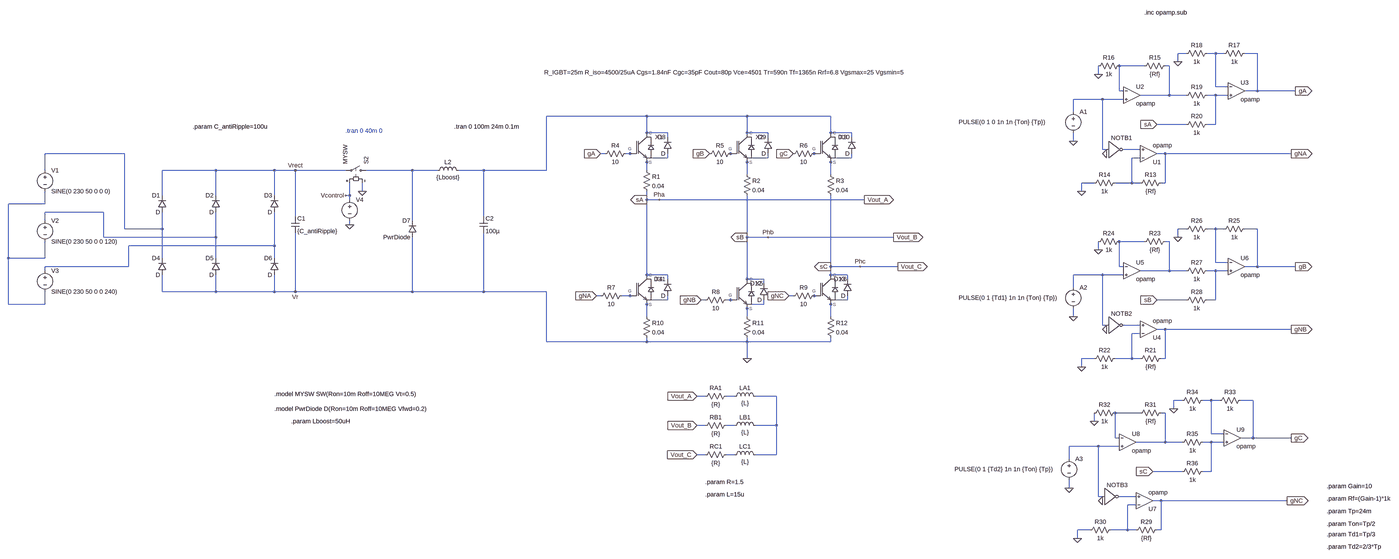
[diagram p0: schematic CompleteServoAmplifierCircuit.asc, whole sheet]
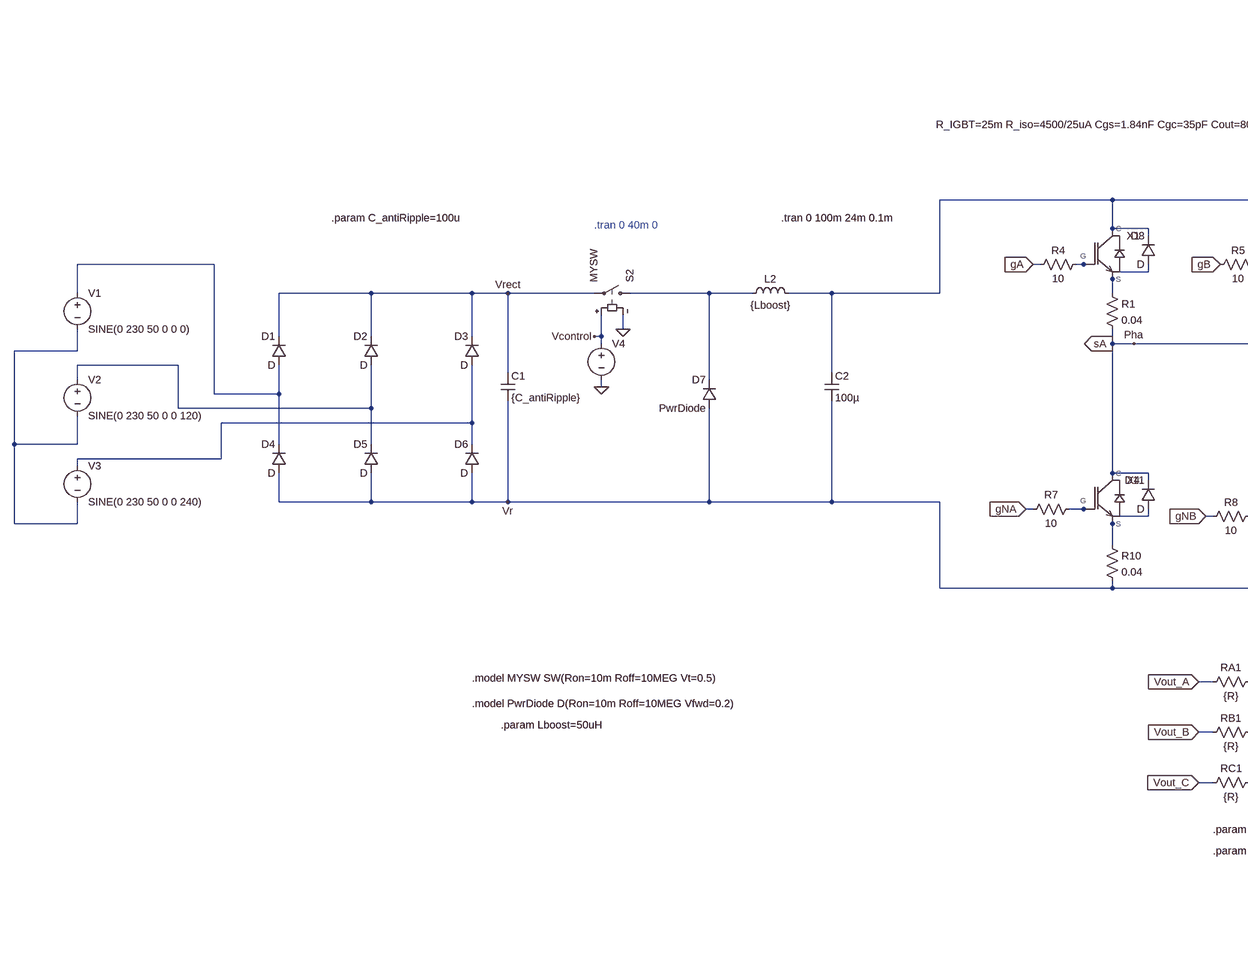
[diagram p1: schematic CompleteServoAmplifierCircuit.asc, part, row 1 of 1, column 1 of 2]
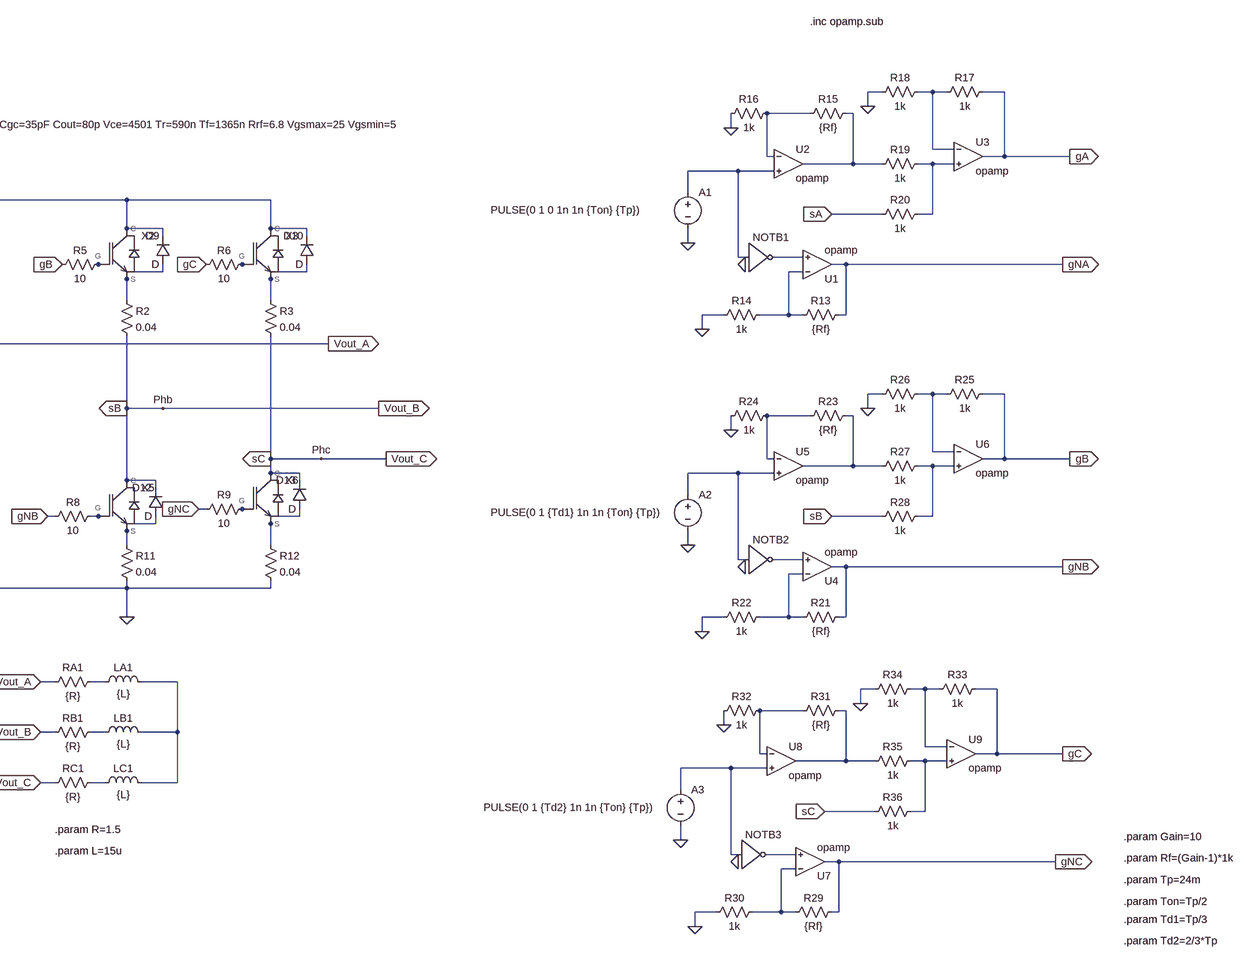
[diagram p2: schematic CompleteServoAmplifierCircuit.asc, part, row 1 of 1, column 2 of 2]
CompleteServoAmplifierCircuit.asc, the LTspice schematic file:
Version 4
SHEET 1 5052 1440
WIRE 4000 -464 3968 -464
WIRE 4112 -464 4080 -464
WIRE 4144 -464 4112 -464
WIRE 4272 -464 4224 -464
WIRE 3968 -432 3968 -464
WIRE 3840 -416 3744 -416
WIRE 3936 -416 3920 -416
WIRE 3664 -384 3664 -416
WIRE 4112 -336 4112 -464
WIRE 4160 -336 4112 -336
WIRE 3744 -320 3744 -416
WIRE 3760 -320 3744 -320
WIRE 4272 -320 4272 -464
WIRE 4272 -320 4224 -320
WIRE 4656 -320 4272 -320
WIRE 3936 -304 3936 -416
WIRE 3936 -304 3824 -304
WIRE 4000 -304 3936 -304
WIRE 4112 -304 4080 -304
WIRE 4160 -304 4112 -304
WIRE 3680 -288 3568 -288
WIRE 3760 -288 3680 -288
WIRE 3568 -240 3568 -288
WIRE 1872 -224 1488 -224
WIRE 2256 -224 1872 -224
WIRE 2576 -224 2256 -224
WIRE 4000 -192 3888 -192
WIRE 4112 -192 4112 -304
WIRE 4112 -192 4080 -192
WIRE 1872 -160 1872 -224
WIRE 1952 -160 1872 -160
WIRE 2256 -160 2256 -224
WIRE 2336 -160 2256 -160
WIRE 2576 -160 2576 -224
WIRE 2656 -160 2576 -160
WIRE 1952 -144 1952 -160
WIRE 2336 -144 2336 -160
WIRE 2656 -144 2656 -160
WIRE 3568 -128 3568 -160
WIRE 3680 -96 3680 -288
WIRE 3696 -96 3680 -96
WIRE 3824 -96 3760 -96
WIRE -160 -80 -464 -80
WIRE 1712 -80 1696 -80
WIRE 1808 -80 1792 -80
WIRE 1824 -80 1808 -80
WIRE 2208 -80 2192 -80
WIRE 2528 -80 2512 -80
WIRE 3920 -80 3888 -80
WIRE 4640 -80 3920 -80
WIRE 1952 -64 1952 -80
WIRE 1952 -64 1872 -64
WIRE 2336 -64 2336 -80
WIRE 2336 -64 2256 -64
WIRE 2656 -64 2656 -80
WIRE 2656 -64 2576 -64
WIRE 3824 -64 3792 -64
WIRE 1872 -48 1872 -64
WIRE 2256 -48 2256 -64
WIRE 2576 -48 2576 -64
WIRE -464 -16 -464 -80
WIRE 224 -16 -16 -16
WIRE 448 -16 224 -16
WIRE 528 -16 448 -16
WIRE 720 -16 528 -16
WIRE 976 -16 800 -16
WIRE 1072 -16 976 -16
WIRE 1248 -16 1152 -16
WIRE 1488 -16 1488 -224
WIRE 1488 -16 1248 -16
WIRE 1872 -16 1872 -48
WIRE 2256 0 2256 -48
WIRE 2576 0 2576 -48
WIRE 3648 32 3600 32
WIRE 3792 32 3792 -64
WIRE 3792 32 3728 32
WIRE 3824 32 3792 32
WIRE 3920 32 3920 -80
WIRE 3920 32 3904 32
WIRE 784 64 784 32
WIRE 3600 64 3600 32
WIRE -16 80 -16 -16
WIRE 224 80 224 -16
WIRE 448 80 448 -16
WIRE 736 80 736 32
WIRE 736 80 720 80
WIRE 736 96 736 80
WIRE 1872 96 1872 64
WIRE 1920 96 1872 96
WIRE 2704 96 1920 96
WIRE -464 112 -464 64
WIRE -464 112 -656 112
WIRE -240 144 -464 144
WIRE 528 160 528 -16
WIRE 1248 160 1248 -16
WIRE -464 176 -464 144
WIRE 976 176 976 -16
WIRE 736 192 736 176
WIRE -160 208 -160 -80
WIRE -16 208 -16 144
WIRE -16 208 -160 208
WIRE 4000 208 3968 208
WIRE 4112 208 4080 208
WIRE 4144 208 4112 208
WIRE 4272 208 4224 208
WIRE -240 240 -240 144
WIRE 224 240 224 144
WIRE 224 240 -240 240
WIRE 2256 240 2256 80
WIRE 2336 240 2256 240
WIRE 2816 240 2336 240
WIRE 3968 240 3968 208
WIRE 3840 256 3744 256
WIRE 3936 256 3920 256
WIRE 448 272 448 144
WIRE 448 272 -144 272
WIRE 3664 288 3664 256
WIRE -656 320 -656 112
WIRE -464 320 -464 256
WIRE -464 320 -656 320
WIRE -16 320 -16 208
WIRE 224 320 224 240
WIRE 448 320 448 272
WIRE 4112 336 4112 208
WIRE 4160 336 4112 336
WIRE -144 352 -144 272
WIRE -144 352 -464 352
WIRE 2576 352 2576 80
WIRE 2688 352 2576 352
WIRE 2832 352 2688 352
WIRE 3744 352 3744 256
WIRE 3760 352 3744 352
WIRE 4272 352 4272 208
WIRE 4272 352 4224 352
WIRE 4656 352 4272 352
WIRE -464 368 -464 352
WIRE 3936 368 3936 256
WIRE 3936 368 3824 368
WIRE 4000 368 3936 368
WIRE 4112 368 4080 368
WIRE 4160 368 4112 368
WIRE 1872 384 1872 96
WIRE 1952 384 1872 384
WIRE 2576 384 2576 352
WIRE 2640 384 2576 384
WIRE 3680 384 3568 384
WIRE 3760 384 3680 384
WIRE 1952 400 1952 384
WIRE 2256 400 2256 240
WIRE 2320 400 2256 400
WIRE 2640 400 2640 384
WIRE 2320 416 2320 400
WIRE 3568 432 3568 384
WIRE -16 448 -16 384
WIRE 224 448 224 384
WIRE 224 448 -16 448
WIRE 448 448 448 384
WIRE 448 448 224 448
WIRE 528 448 528 224
WIRE 528 448 448 448
WIRE 976 448 976 240
WIRE 976 448 528 448
WIRE 1248 448 1248 224
WIRE 1248 448 976 448
WIRE 1488 448 1248 448
WIRE 1696 464 1680 464
WIRE 1808 464 1776 464
WIRE 1824 464 1808 464
WIRE 2432 464 2416 464
WIRE 2528 464 2512 464
WIRE 1952 480 1952 464
WIRE 1952 480 1872 480
WIRE 2096 480 2080 480
WIRE 2192 480 2176 480
WIRE 2208 480 2192 480
WIRE 2640 480 2640 464
WIRE 2640 480 2576 480
WIRE 4000 480 3888 480
WIRE 4112 480 4112 368
WIRE 4112 480 4080 480
WIRE -656 496 -656 320
WIRE -464 496 -464 448
WIRE -464 496 -656 496
WIRE 1872 496 1872 480
WIRE 2320 496 2320 480
WIRE 2320 496 2256 496
WIRE 2576 496 2576 480
WIRE 2256 512 2256 496
WIRE 1872 544 1872 496
WIRE 2256 544 2256 512
WIRE 2576 544 2576 496
WIRE 3568 544 3568 512
WIRE 3680 576 3680 384
WIRE 3696 576 3680 576
WIRE 3824 576 3760 576
WIRE 3920 592 3888 592
WIRE 4640 592 3920 592
WIRE 3824 608 3792 608
WIRE 1488 640 1488 448
WIRE 1872 640 1872 624
WIRE 1872 640 1488 640
WIRE 2256 640 2256 624
WIRE 2256 640 1872 640
WIRE 2576 640 2576 624
WIRE 2576 640 2256 640
WIRE 2256 704 2256 640
WIRE 3648 704 3600 704
WIRE 3792 704 3792 608
WIRE 3792 704 3728 704
WIRE 3824 704 3792 704
WIRE 3920 704 3920 592
WIRE 3920 704 3904 704
WIRE 3600 736 3600 704
WIRE 2096 848 2064 848
WIRE 2208 848 2176 848
WIRE 2368 848 2288 848
WIRE 3984 864 3952 864
WIRE 4096 864 4064 864
WIRE 4128 864 4096 864
WIRE 4256 864 4208 864
WIRE 3952 896 3952 864
WIRE 3824 912 3728 912
WIRE 3920 912 3904 912
WIRE 3648 944 3648 912
WIRE 2096 960 2064 960
WIRE 2208 960 2176 960
WIRE 2368 960 2368 848
WIRE 2368 960 2288 960
WIRE 4096 992 4096 864
WIRE 4144 992 4096 992
WIRE 3728 1008 3728 912
WIRE 3744 1008 3728 1008
WIRE 4256 1008 4256 864
WIRE 4256 1008 4208 1008
WIRE 4640 1008 4256 1008
WIRE 3920 1024 3920 912
WIRE 3920 1024 3808 1024
WIRE 3984 1024 3920 1024
WIRE 4096 1024 4064 1024
WIRE 4144 1024 4096 1024
WIRE 3664 1040 3552 1040
WIRE 3744 1040 3664 1040
WIRE 2096 1072 2064 1072
WIRE 2208 1072 2176 1072
WIRE 2368 1072 2368 960
WIRE 2368 1072 2288 1072
WIRE 3552 1088 3552 1040
WIRE 3984 1136 3872 1136
WIRE 4096 1136 4096 1024
WIRE 4096 1136 4064 1136
WIRE 3552 1200 3552 1168
WIRE 3664 1232 3664 1040
WIRE 3680 1232 3664 1232
WIRE 3808 1232 3744 1232
WIRE 3904 1248 3872 1248
WIRE 4624 1248 3904 1248
WIRE 3808 1264 3776 1264
WIRE 3632 1360 3584 1360
WIRE 3776 1360 3776 1264
WIRE 3776 1360 3712 1360
WIRE 3808 1360 3776 1360
WIRE 3904 1360 3904 1248
WIRE 3904 1360 3888 1360
WIRE 3584 1392 3584 1360
FLAG 528 -16 Vrect
FLAG 528 448 Vr
FLAG 784 64 0
FLAG 736 192 0
FLAG 720 80 Vcontrol
FLAG 2064 848 Vout_A
IOPIN 2064 848 In
FLAG 2064 960 Vout_B
IOPIN 2064 960 In
FLAG 2064 1072 Vout_C
IOPIN 2064 1072 In
FLAG 2256 704 0
FLAG 1920 96 Pha
FLAG 2336 240 Phb
FLAG 2688 352 Phc
FLAG 1680 464 gNA
IOPIN 1680 464 In
FLAG 1696 -80 gA
IOPIN 1696 -80 In
FLAG 2112 -80 gB
IOPIN 2112 -80 In
FLAG 2432 -80 gC
IOPIN 2432 -80 In
FLAG 2080 480 gNB
IOPIN 2080 480 In
FLAG 2416 464 gNC
IOPIN 2416 464 In
FLAG 2704 96 Vout_A
IOPIN 2704 96 Out
FLAG 2816 240 Vout_B
IOPIN 2816 240 Out
FLAG 2832 352 Vout_C
IOPIN 2832 352 Out
FLAG 1872 96 sA
IOPIN 1872 96 Out
FLAG 2256 240 sB
IOPIN 2256 240 Out
FLAG 2576 352 sC
IOPIN 2576 352 Out
FLAG 4656 -320 gA
IOPIN 4656 -320 Out
FLAG 4640 -80 gNA
IOPIN 4640 -80 Out
FLAG 3568 -128 0
FLAG 3696 -80 0
FLAG 3600 64 0
FLAG 3664 -384 0
FLAG 3888 -192 sA
IOPIN 3888 -192 In
FLAG 3968 -432 0
FLAG 4656 352 gB
IOPIN 4656 352 Out
FLAG 4640 592 gNB
IOPIN 4640 592 Out
FLAG 3568 544 0
FLAG 3696 592 0
FLAG 3600 736 0
FLAG 3664 288 0
FLAG 3888 480 sB
IOPIN 3888 480 In
FLAG 3968 240 0
FLAG 4640 1008 gC
IOPIN 4640 1008 Out
FLAG 4624 1248 gNC
IOPIN 4624 1248 Out
FLAG 3552 1200 0
FLAG 3680 1248 0
FLAG 3584 1392 0
FLAG 3648 944 0
FLAG 3872 1136 sC
IOPIN 3872 1136 In
FLAG 3952 896 0
SYMBOL diode 0 144 R180
WINDOW 0 24 64 Left 2
WINDOW 3 24 0 Left 2
SYMATTR InstName D1
SYMBOL diode 240 144 R180
WINDOW 0 24 64 Left 2
WINDOW 3 24 0 Left 2
SYMATTR InstName D2
SYMBOL diode 464 144 R180
WINDOW 0 24 64 Left 2
WINDOW 3 24 0 Left 2
SYMATTR InstName D3
SYMBOL diode 0 384 R180
WINDOW 0 24 64 Left 2
WINDOW 3 24 0 Left 2
SYMATTR InstName D4
SYMBOL diode 240 384 R180
WINDOW 0 24 64 Left 2
WINDOW 3 24 0 Left 2
SYMATTR InstName D5
SYMBOL diode 464 384 R180
WINDOW 0 24 64 Left 2
WINDOW 3 24 0 Left 2
SYMATTR InstName D6
SYMBOL voltage -464 -32 R0
WINDOW 123 0 0 Left 0
WINDOW 39 0 0 Left 0
SYMATTR InstName V1
SYMATTR Value SINE(0 230 50 0 0 0)
SYMBOL voltage -464 160 R0
WINDOW 123 0 0 Left 0
WINDOW 39 0 0 Left 0
SYMATTR InstName V2
SYMATTR Value SINE(0 230 50 0 0 120)
SYMBOL voltage -464 352 R0
WINDOW 123 0 0 Left 0
WINDOW 39 0 0 Left 0
SYMATTR InstName V3
SYMATTR Value SINE(0 230 50 0 0 240)
SYMBOL sw 816 -16 M270
SYMATTR InstName S2
SYMATTR Value MYSW
SYMBOL voltage 736 80 R0
WINDOW 3 15 111 Invisible 2
WINDOW 123 0 0 Left 0
WINDOW 39 0 0 Left 0
SYMATTR Value PULSE(0 1 0 1n 1n {0.054*50u} 50u)
SYMATTR InstName V4
SYMBOL ind 1056 0 R270
WINDOW 0 32 56 VTop 2
WINDOW 3 5 56 VBottom 2
SYMATTR InstName L2
SYMATTR Value {Lboost}
SYMBOL diode 992 240 R180
WINDOW 0 24 64 Left 2
WINDOW 3 24 0 Left 2
SYMATTR InstName D7
SYMATTR Value PwrDiode
SYMBOL cap 1232 160 R0
SYMATTR InstName C2
SYMATTR Value 100µ
SYMBOL ind 2192 864 R270
WINDOW 0 32 56 VTop 2
WINDOW 3 5 56 VBottom 2
SYMATTR InstName LA1
SYMATTR Value {L}
SYMBOL ind 2192 976 R270
WINDOW 0 32 56 VTop 2
WINDOW 3 5 56 VBottom 2
SYMATTR InstName LB1
SYMATTR Value {L}
SYMBOL ind 2192 1088 R270
WINDOW 0 32 56 VTop 2
WINDOW 3 5 56 VBottom 2
SYMATTR InstName LC1
SYMATTR Value {L}
SYMBOL res 2080 864 R270
WINDOW 0 32 56 VTop 2
WINDOW 3 0 56 VBottom 2
SYMATTR InstName RA1
SYMATTR Value {R}
SYMBOL res 2080 976 R270
WINDOW 0 32 56 VTop 2
WINDOW 3 0 56 VBottom 2
SYMATTR InstName RB1
SYMATTR Value {R}
SYMBOL res 2080 1088 R270
WINDOW 0 32 56 VTop 2
WINDOW 3 0 56 VBottom 2
SYMATTR InstName RC1
SYMATTR Value {R}
SYMBOL IGBT_model 1840 -64 R0
WINDOW 39 -360 -327 Left 2
SYMATTR SpiceLine R_IGBT=25m R_iso=4500/25uA Cgs=1.84nF Cgc=35pF Cout=80p Vce=4501 Tr=590n Tf=1365n Rrf=6.8 Vgsmax=25 Vgsmin=5
SYMATTR InstName X1
SYMBOL IGBT_model 2224 -64 R0
SYMATTR SpiceLine R_IGBT=25m R_iso=4500/25uA Cgs=1.84nF Cgc=35pF Cout=80p Vce=4501 Tr=590n Tf=1365n Rrf=6.8 Vgsmax=25 Vgsmin=5
SYMATTR InstName X2
SYMBOL IGBT_model 2544 -64 R0
SYMATTR SpiceLine R_IGBT=25m R_iso=4500/25uA Cgs=1.84nF Cgc=35pF Cout=80p Vce=4501 Tr=590n Tf=1365n Rrf=6.8 Vgsmax=25 Vgsmin=5
SYMATTR InstName X3
SYMBOL IGBT_model 1840 480 R0
SYMATTR SpiceLine R_IGBT=25m R_iso=4500/25uA Cgs=1.84nF Cgc=35pF Cout=80p Vce=4501 Tr=590n Tf=1365n Rrf=6.8 Vgsmax=25 Vgsmin=5
SYMATTR InstName X4
SYMBOL IGBT_model 2224 496 R0
SYMATTR SpiceLine R_IGBT=25m R_iso=4500/25uA Cgs=1.84nF Cgc=35pF Cout=80p Vce=4501 Tr=590n Tf=1365n Rrf=6.8 Vgsmax=25 Vgsmin=5
SYMATTR InstName X5
SYMBOL IGBT_model 2544 480 R0
SYMATTR SpiceLine R_IGBT=25m R_iso=4500/25uA Cgs=1.84nF Cgc=35pF Cout=80p Vce=4501 Tr=590n Tf=1365n Rrf=6.8 Vgsmax=25 Vgsmin=5
SYMATTR InstName X6
SYMBOL res 1856 -32 R0
SYMATTR InstName R1
SYMATTR Value 0.04
SYMBOL res 2240 -16 R0
SYMATTR InstName R2
SYMATTR Value 0.04
SYMBOL res 2560 -16 R0
SYMATTR InstName R3
SYMATTR Value 0.04
SYMBOL res 1808 -96 R90
WINDOW 0 0 56 VBottom 2
WINDOW 3 32 56 VTop 2
SYMATTR InstName R4
SYMATTR Value 10
SYMBOL res 2208 -96 R90
WINDOW 0 0 56 VBottom 2
WINDOW 3 32 56 VTop 2
SYMATTR InstName R5
SYMATTR Value 10
SYMBOL res 2528 -96 R90
WINDOW 0 0 56 VBottom 2
WINDOW 3 32 56 VTop 2
SYMATTR InstName R6
SYMATTR Value 10
SYMBOL res 1792 448 R90
WINDOW 0 0 56 VBottom 2
WINDOW 3 32 56 VTop 2
SYMATTR InstName R7
SYMATTR Value 10
SYMBOL res 2192 464 R90
WINDOW 0 0 56 VBottom 2
WINDOW 3 32 56 VTop 2
SYMATTR InstName R8
SYMATTR Value 10
SYMBOL res 2528 448 R90
WINDOW 0 0 56 VBottom 2
WINDOW 3 32 56 VTop 2
SYMATTR InstName R9
SYMATTR Value 10
SYMBOL res 1856 528 R0
SYMATTR InstName R10
SYMATTR Value 0.04
SYMBOL res 2240 528 R0
SYMATTR InstName R11
SYMATTR Value 0.04
SYMBOL res 2560 528 R0
SYMATTR InstName R12
SYMATTR Value 0.04
SYMBOL cap 512 160 R0
SYMATTR InstName C1
SYMATTR Value {C_antiRipple}
SYMBOL voltage 3568 -256 R0
WINDOW 3 -438 55 Left 2
WINDOW 123 0 0 Left 0
WINDOW 39 0 0 Left 0
SYMATTR Value PULSE(0 1 0 1n 1n {Ton} {Tp})
SYMATTR InstName A1
SYMBOL Digital\\inv 3696 -160 R0
WINDOW 0 16 20 Left 2
SYMATTR InstName NOTB1
SYMBOL OpAmps\\opamp 3856 -16 M180
SYMATTR InstName U1
SYMBOL res 3920 16 R90
WINDOW 0 0 56 VBottom 2
WINDOW 3 32 56 VTop 2
SYMATTR InstName R13
SYMATTR Value {Rf}
SYMBOL res 3632 48 R270
WINDOW 0 32 56 VTop 2
WINDOW 3 0 56 VBottom 2
SYMATTR InstName R14
SYMATTR Value 1k
SYMBOL res 3936 -432 R90
WINDOW 0 0 56 VBottom 2
WINDOW 3 32 56 VTop 2
SYMATTR InstName R15
SYMATTR Value {Rf}
SYMBOL res 3648 -400 R270
WINDOW 0 32 56 VTop 2
WINDOW 3 0 56 VBottom 2
SYMATTR InstName R16
SYMATTR Value 1k
SYMBOL OpAmps\\opamp 3792 -368 R0
SYMATTR InstName U2
SYMBOL OpAmps\\opamp 4192 -384 R0
SYMATTR InstName U3
SYMBOL res 4240 -480 R90
WINDOW 0 0 56 VBottom 2
WINDOW 3 32 56 VTop 2
SYMATTR InstName R17
SYMATTR Value 1k
SYMBOL res 4096 -480 R90
WINDOW 0 0 56 VBottom 2
WINDOW 3 32 56 VTop 2
SYMATTR InstName R18
SYMATTR Value 1k
SYMBOL res 4096 -320 R90
WINDOW 0 0 56 VBottom 2
WINDOW 3 32 56 VTop 2
SYMATTR InstName R19
SYMATTR Value 1k
SYMBOL res 4096 -208 R90
WINDOW 0 0 56 VBottom 2
WINDOW 3 32 56 VTop 2
SYMATTR InstName R20
SYMATTR Value 1k
SYMBOL voltage 3568 416 R0
WINDOW 3 -438 55 Left 2
WINDOW 123 0 0 Left 0
WINDOW 39 0 0 Left 0
SYMATTR Value PULSE(0 1 {Td1} 1n 1n {Ton} {Tp})
SYMATTR InstName A2
SYMBOL Digital\\inv 3696 512 R0
WINDOW 0 16 20 Left 2
SYMATTR InstName NOTB2
SYMBOL OpAmps\\opamp 3856 656 M180
SYMATTR InstName U4
SYMBOL res 3920 688 R90
WINDOW 0 0 56 VBottom 2
WINDOW 3 32 56 VTop 2
SYMATTR InstName R21
SYMATTR Value {Rf}
SYMBOL res 3632 720 R270
WINDOW 0 32 56 VTop 2
WINDOW 3 0 56 VBottom 2
SYMATTR InstName R22
SYMATTR Value 1k
SYMBOL res 3936 240 R90
WINDOW 0 0 56 VBottom 2
WINDOW 3 32 56 VTop 2
SYMATTR InstName R23
SYMATTR Value {Rf}
SYMBOL res 3648 272 R270
WINDOW 0 32 56 VTop 2
WINDOW 3 0 56 VBottom 2
SYMATTR InstName R24
SYMATTR Value 1k
SYMBOL OpAmps\\opamp 3792 304 R0
SYMATTR InstName U5
SYMBOL OpAmps\\opamp 4192 288 R0
SYMATTR InstName U6
SYMBOL res 4240 192 R90
WINDOW 0 0 56 VBottom 2
WINDOW 3 32 56 VTop 2
SYMATTR InstName R25
SYMATTR Value 1k
SYMBOL res 4096 192 R90
WINDOW 0 0 56 VBottom 2
WINDOW 3 32 56 VTop 2
SYMATTR InstName R26
SYMATTR Value 1k
SYMBOL res 4096 352 R90
WINDOW 0 0 56 VBottom 2
WINDOW 3 32 56 VTop 2
SYMATTR InstName R27
SYMATTR Value 1k
SYMBOL res 4096 464 R90
WINDOW 0 0 56 VBottom 2
WINDOW 3 32 56 VTop 2
SYMATTR InstName R28
SYMATTR Value 1k
SYMBOL voltage 3552 1072 R0
WINDOW 3 -438 55 Left 2
WINDOW 123 0 0 Left 0
WINDOW 39 0 0 Left 0
SYMATTR Value PULSE(0 1 {Td2} 1n 1n {Ton} {Tp})
SYMATTR InstName A3
SYMBOL Digital\\inv 3680 1168 R0
WINDOW 0 16 20 Left 2
SYMATTR InstName NOTB3
SYMBOL OpAmps\\opamp 3840 1312 M180
SYMATTR InstName U7
SYMBOL res 3904 1344 R90
WINDOW 0 0 56 VBottom 2
WINDOW 3 32 56 VTop 2
SYMATTR InstName R29
SYMATTR Value {Rf}
SYMBOL res 3616 1376 R270
WINDOW 0 32 56 VTop 2
WINDOW 3 0 56 VBottom 2
SYMATTR InstName R30
SYMATTR Value 1k
SYMBOL res 3920 896 R90
WINDOW 0 0 56 VBottom 2
WINDOW 3 32 56 VTop 2
SYMATTR InstName R31
SYMATTR Value {Rf}
SYMBOL res 3632 928 R270
WINDOW 0 32 56 VTop 2
WINDOW 3 0 56 VBottom 2
SYMATTR InstName R32
SYMATTR Value 1k
SYMBOL OpAmps\\opamp 3776 960 R0
SYMATTR InstName U8
SYMBOL OpAmps\\opamp 4176 944 R0
SYMATTR InstName U9
SYMBOL res 4224 848 R90
WINDOW 0 0 56 VBottom 2
WINDOW 3 32 56 VTop 2
SYMATTR InstName R33
SYMATTR Value 1k
SYMBOL res 4080 848 R90
WINDOW 0 0 56 VBottom 2
WINDOW 3 32 56 VTop 2
SYMATTR InstName R34
SYMATTR Value 1k
SYMBOL res 4080 1008 R90
WINDOW 0 0 56 VBottom 2
WINDOW 3 32 56 VTop 2
SYMATTR InstName R35
SYMATTR Value 1k
SYMBOL res 4080 1120 R90
WINDOW 0 0 56 VBottom 2
WINDOW 3 32 56 VTop 2
SYMATTR InstName R36
SYMATTR Value 1k
SYMBOL diode 1968 -80 R180
WINDOW 0 24 64 Left 2
WINDOW 3 24 0 Left 2
SYMATTR InstName D8
SYMBOL diode 2352 -80 R180
WINDOW 0 24 64 Left 2
WINDOW 3 24 0 Left 2
SYMATTR InstName D9
SYMBOL diode 2672 -80 R180
WINDOW 0 24 64 Left 2
WINDOW 3 24 0 Left 2
SYMATTR InstName D10
SYMBOL diode 1968 464 R180
WINDOW 0 24 64 Left 2
WINDOW 3 24 0 Left 2
SYMATTR InstName D11
SYMBOL diode 2336 480 R180
WINDOW 0 24 64 Left 2
WINDOW 3 24 0 Left 2
SYMATTR InstName D12
SYMBOL diode 2656 464 R180
WINDOW 0 24 64 Left 2
WINDOW 3 24 0 Left 2
SYMATTR InstName D13
TEXT 720 -168 Left 2 ;.tran 0 40m 0
TEXT 136 -184 Left 2 !.param C_antiRipple=100u
TEXT 448 840 Left 2 !.model MYSW SW(Ron=10m Roff=10MEG Vt=0.5)
TEXT 512 944 Left 2 !.param Lboost=50uH
TEXT 448 896 Left 2 !.model PwrDiode D(Ron=10m Roff=10MEG Vfwd=0.2)
TEXT 1136 -184 Left 2 !.tran 0 100m 24m 0.1m
TEXT 2096 1176 Left 2 !.param R=1.5
TEXT 2096 1224 Left 2 !.param L=15u
TEXT 4776 1288 Left 2 !.param Tp=24m
TEXT 4776 1336 Left 2 !.param Ton=Tp/2
TEXT 4776 1376 Left 2 !.param Td1=Tp/3
TEXT 4776 1192 Left 2 !.param Gain=10
TEXT 3840 -624 Left 2 !.inc opamp.sub
TEXT 4776 1240 Left 2 !.param Rf=(Gain-1)*1k
TEXT 4776 1424 Left 2 !.param Td2=2/3*Tp

The netlist it stands for:
* CompleteServoAmplifierCircuit.asc
D1 N008 Vrect D
D2 N018 Vrect D
D3 N022 Vrect D
D4 0 N008 D
D5 0 N018 D
D6 0 N022 D
V1 N008 N017 SINE(0 230 50 0 0 0)
V2 N018 N017 SINE(0 230 50 0 0 120)
V3 N022 N017 SINE(0 230 50 0 0 240)
S2 N016 Vrect Vcontrol 0 MYSW
V4 Vcontrol 0 PULSE(0 1 0 1n 1n {0.054*50u} 50u)
L2 N016 N006 {Lboost}
D7 0 N016 PwrDiode
C2 N006 0 100µ
LA1 N033 N034 {L}
LB1 N038 N034 {L}
LC1 N041 N034 {L}
RA1 sA N033 {R}
RB1 sB N038 {R}
RC1 sC N041 {R}
XX1 N006 N009 N012 IGBT_model params: R_IGBT=25m R_iso=4500/25uA Cgs=1.84nF Cgc=35pF Cout=80p Vce=4501 Tr=590n Tf=1365n Rrf=6.8 Vgsmax=25 Vgsmin=5  ; pins C G S
XX2 N006 N010 N013 IGBT_model params: R_IGBT=25m R_iso=4500/25uA Cgs=1.84nF Cgc=35pF Cout=80p Vce=4501 Tr=590n Tf=1365n Rrf=6.8 Vgsmax=25 Vgsmin=5  ; pins C G S
XX3 N006 N011 N014 IGBT_model params: R_IGBT=25m R_iso=4500/25uA Cgs=1.84nF Cgc=35pF Cout=80p Vce=4501 Tr=590n Tf=1365n Rrf=6.8 Vgsmax=25 Vgsmin=5  ; pins C G S
XX4 sA N025 N027 IGBT_model params: R_IGBT=25m R_iso=4500/25uA Cgs=1.84nF Cgc=35pF Cout=80p Vce=4501 Tr=590n Tf=1365n Rrf=6.8 Vgsmax=25 Vgsmin=5  ; pins C G S
XX5 sB N028 N030 IGBT_model params: R_IGBT=25m R_iso=4500/25uA Cgs=1.84nF Cgc=35pF Cout=80p Vce=4501 Tr=590n Tf=1365n Rrf=6.8 Vgsmax=25 Vgsmin=5  ; pins C G S
XX6 sC N026 N029 IGBT_model params: R_IGBT=25m R_iso=4500/25uA Cgs=1.84nF Cgc=35pF Cout=80p Vce=4501 Tr=590n Tf=1365n Rrf=6.8 Vgsmax=25 Vgsmin=5  ; pins C G S
R1 N012 sA 0.04
R2 N013 sB 0.04
R3 N014 sC 0.04
R4 N009 gA 10
R5 N010 gB 10
R6 N011 gC 10
R7 N025 gNA 10
R8 N028 gNB 10
R9 N026 gNC 10
R10 N027 0 0.04
R11 N030 0 0.04
R12 N029 0 0.04
C1 Vrect 0 {C_antiRipple}
V§A1 N005 0 PULSE(0 1 0 1n 1n {Ton} {Tp})
A§NOTB1 N005 0 0 0 0 N007 0 0 BUF
XU1 N015 N007 gNA opamp Aol=100K GBW=10Meg  ; pins invin noninvin out
R13 gNA N015 {Rf}
R14 0 N015 1k
R15 N003 N002 {Rf}
R16 0 N002 1k
XU2 N002 N005 N003 opamp Aol=100K GBW=10Meg  ; pins invin noninvin out
XU3 N001 N004 gA opamp Aol=100K GBW=10Meg  ; pins invin noninvin out
R17 gA N001 1k
R18 N001 0 1k
R19 N004 N003 1k
R20 N004 sA 1k
V§A2 N024 0 PULSE(0 1 {Td1} 1n 1n {Ton} {Tp})
A§NOTB2 N024 0 0 0 0 N031 0 0 BUF
XU4 N032 N031 gNB opamp Aol=100K GBW=10Meg  ; pins invin noninvin out
R21 gNB N032 {Rf}
R22 0 N032 1k
R23 N021 N020 {Rf}
R24 0 N020 1k
XU5 N020 N024 N021 opamp Aol=100K GBW=10Meg  ; pins invin noninvin out
XU6 N019 N023 gB opamp Aol=100K GBW=10Meg  ; pins invin noninvin out
R25 gB N019 1k
R26 N019 0 1k
R27 N023 N021 1k
R28 N023 sB 1k
V§A3 N040 0 PULSE(0 1 {Td2} 1n 1n {Ton} {Tp})
A§NOTB3 N040 0 0 0 0 N042 0 0 BUF
XU7 N043 N042 gNC opamp Aol=100K GBW=10Meg  ; pins invin noninvin out
R29 gNC N043 {Rf}
R30 0 N043 1k
R31 N037 N036 {Rf}
R32 0 N036 1k
XU8 N036 N040 N037 opamp Aol=100K GBW=10Meg  ; pins invin noninvin out
XU9 N035 N039 gC opamp Aol=100K GBW=10Meg  ; pins invin noninvin out
R33 gC N035 1k
R34 N035 0 1k
R35 N039 N037 1k
R36 N039 sC 1k
D8 N012 N006 D
D9 N013 N006 D
D10 N014 N006 D
D11 N027 sA D
D12 N030 sB D
D13 N029 sC D
.model D D
.lib standard.dio
* .tran 0 40m 0
.param C_antiRipple=100u
.model MYSW SW(Ron=10m Roff=10MEG Vt=0.5)
.param Lboost=50uH
.model PwrDiode D(Ron=10m Roff=10MEG Vfwd=0.2)
.tran 0 100m 24m 0.1m
.param R=1.5
.param L=15u
.param Tp=24m
.param Ton=Tp/2
.param Td1=Tp/3
.param Gain=10
.inc opamp.sub
.param Rf=(Gain-1)*1k
.param Td2=2/3*Tp
.backanno
.end